# Altium schematic sheet 密码钥匙球锁191014.Schdoc
size A2; SheetNumber: 0; SheetTotal: 0; PageSetup: Record=PageOptions|CenterHorizontal=True|CenterVertical=True|PrintScale=0.52|XCorrection=1.00|YCorrection=1.00|PrintKind=0|BorderSize=5000000|LeftOffset=0|BottomOffset=0|Orientation=2|PaperLength=1000|PaperWidth=1000|Scale=100|PaperSource=7|PrintQuality=-4|MediaType=1|DitherType=10|PaperKind=A4|PrintScaleMode=1
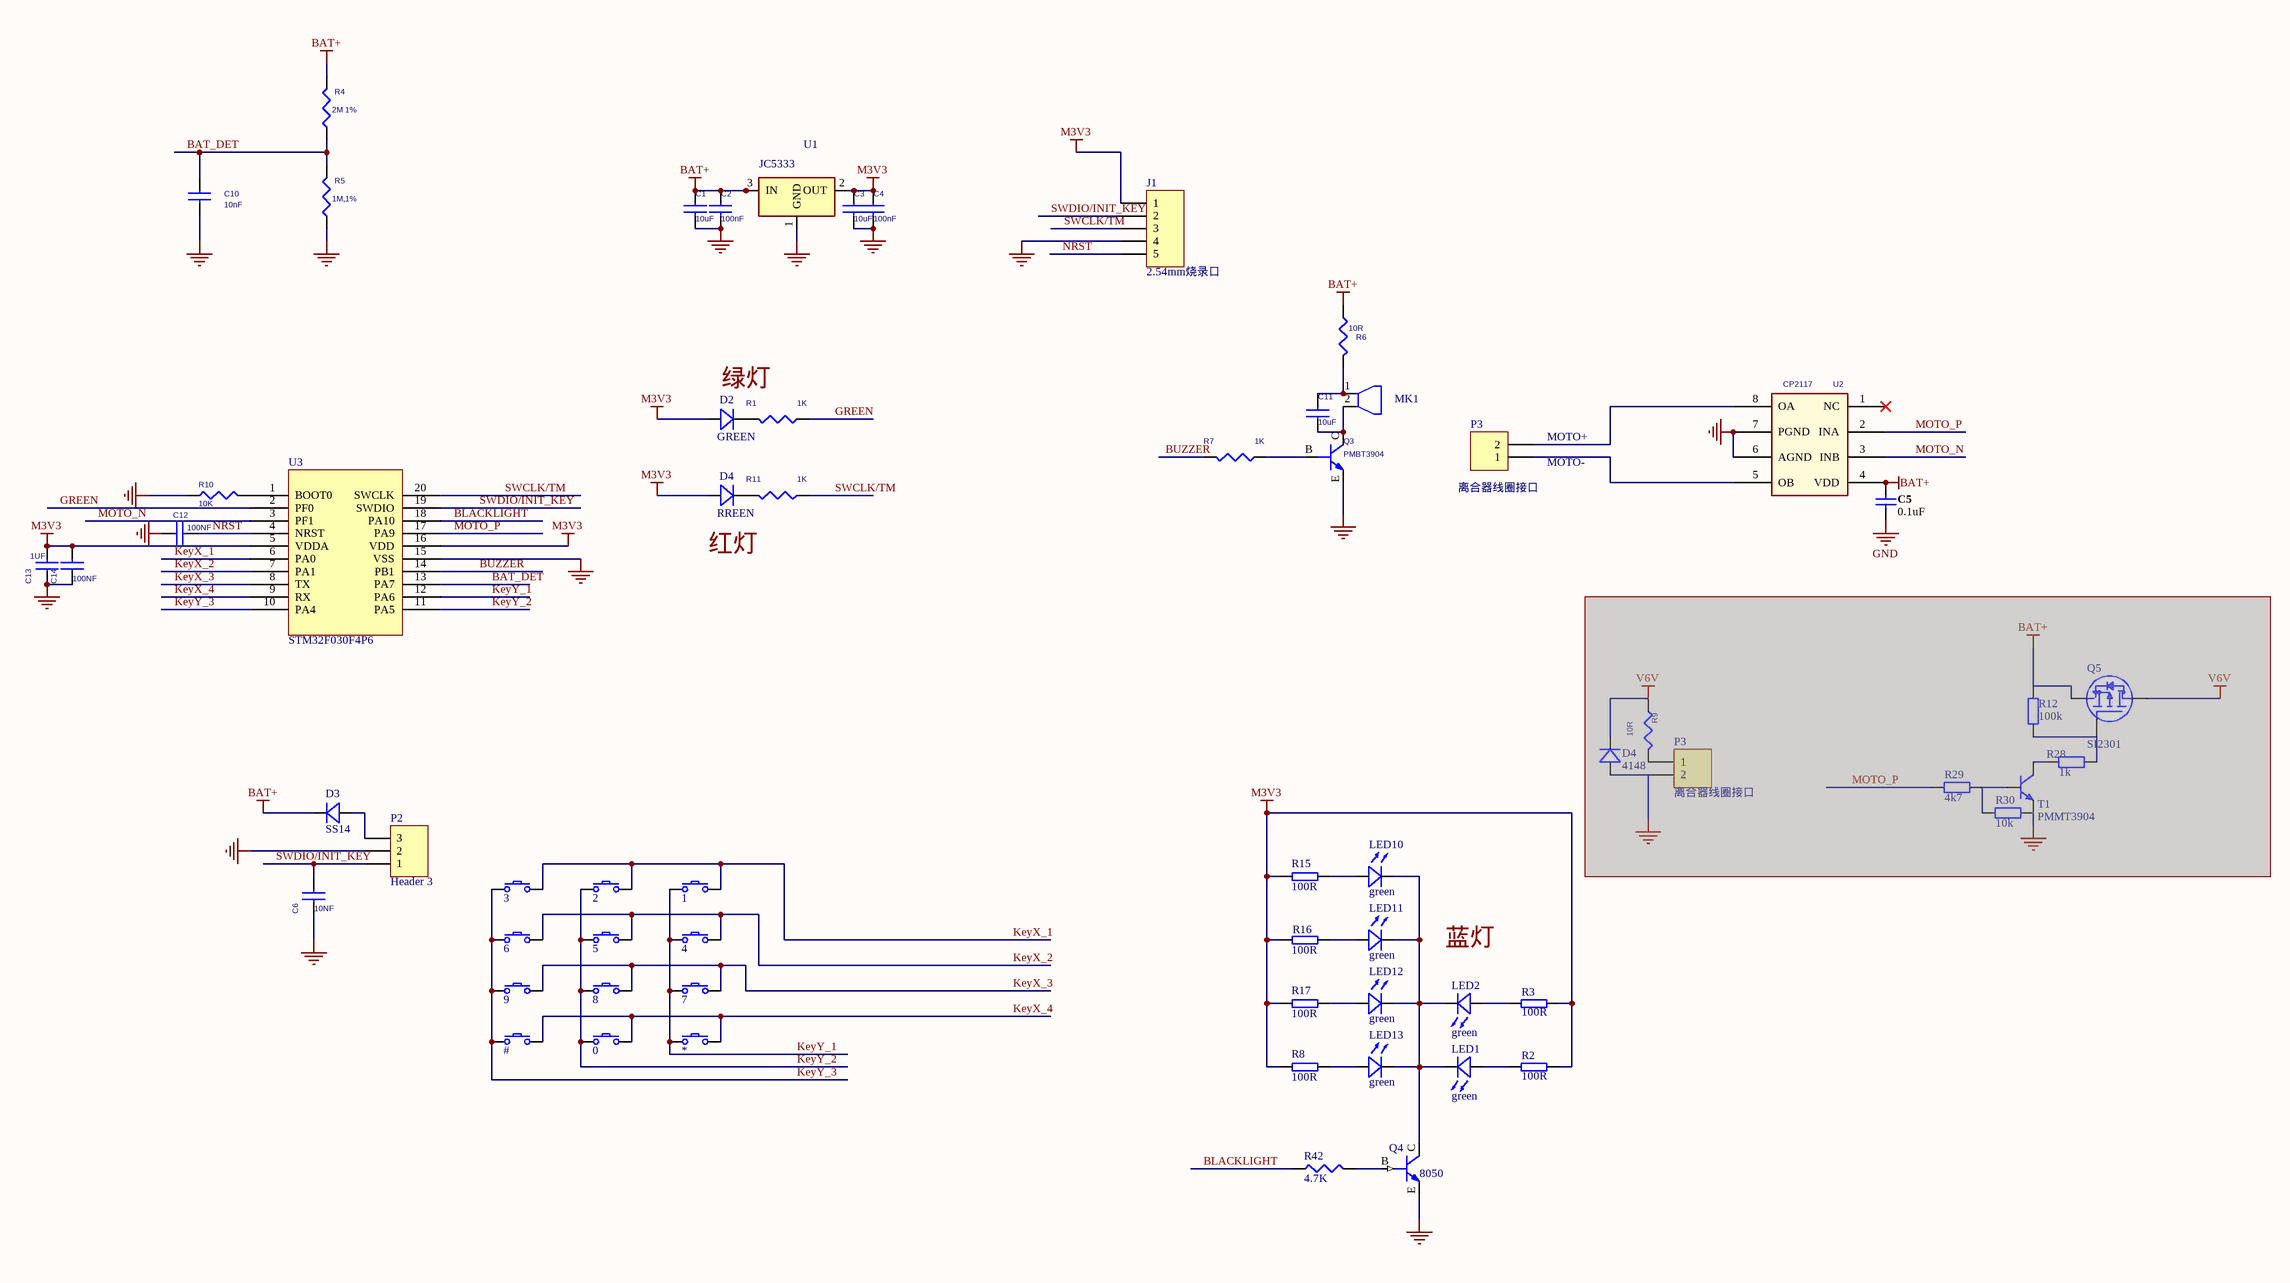
[diagram p0: 密码钥匙球锁191014.Schdoc]

## Parts
(Parts that share a designator on the sheet are numbered #1, #2 ... from top to bottom, then left to right.)
0  SW  [KEY_5.2*3.7*6.4]  (value not drawn)
1  SW  [KEY_5.2*3.7*6.4]  (value not drawn)
2  SW  [KEY_5.2*3.7*6.4]  (value not drawn)
3  SW  [KEY_5.2*3.7*6.4]  (value not drawn)
4  SW  [KEY_5.2*3.7*6.4]  (value not drawn)
5  SW  [KEY_5.2*3.7*6.4]  (value not drawn)
6  SW  [KEY_5.2*3.7*6.4]  (value not drawn)
7  SW  [KEY_5.2*3.7*6.4]  (value not drawn)
8  SW  [KEY_5.2*3.7*6.4]  (value not drawn)
9  SW  [KEY_5.2*3.7*6.4]  (value not drawn)
#  SW  [KEY_5.2*3.7*6.4]  (value not drawn)
*  SW  [KEY_5.2*3.7*6.4]  (value not drawn)
C1  10uF  [C0805X]
C2  100nF  [C0603]
C3  10uF  [C0805X]
C4  100nF  [C0603]
C5  0.1uF  [C0603]
C6  10NF  [C0603]
C10  10nF  [C0603]
C11  10uF  [C0603]
C12  100NF  [C0603]
C13  1UF  [C0603]
C14  100NF  [C0603]
D2  GREEN  [LED(0603)]
D3  SS14  [M7]
D4#1  RREEN  [LED(0603)]
D4#2  4148  [SDO123]  (masked out: inside a compile mask, not in the netlist)
J1  2.54mm烧录口  [5-2.54]
LED1  green  [LED(0603)]
LED2  green  [LED(0603)]
LED10  green  [LED(0603)]
LED11  green  [LED(0603)]
LED12  green  [LED(0603)]
LED13  green  [LED(0603)]
MK1  BUZZER  [BUZZER_D93_L40]  (value not drawn)
P2  Header 3  [3P-2.0]
P3#1  离合器线圈接口  [2P-1.25]
P3#2  离合器线圈接口  [2PIN-2.0]  (masked out: inside a compile mask, not in the netlist)
Q3  PMBT3904  [SOT-23 - BCE]
Q4  8050  [SOT-23 - BCE]
Q5  SI2301  [SOT-23 - GDS]  (masked out: inside a compile mask, not in the netlist)
R1  1K  [R0603]
R2  100R  [R0603]
R3  100R  [R0603]
R4  2M 1%  [R0603]
R5  1M,1%  [R0603]
R6  10R  [R0603]
R7  1K  [R0603]
R8  100R  [R0603]
R9  10R  [R0603]  (masked out: inside a compile mask, not in the netlist)
R10  10K  [R0603]
R11  1K  [R0603]
R12  100k  [R0603]  (masked out: inside a compile mask, not in the netlist)
R15  100R  [R0603]
R16  100R  [R0603]
R17  100R  [R0603]
R28  1k  [R0603]  (masked out: inside a compile mask, not in the netlist)
R29  4k7  [R0603]  (masked out: inside a compile mask, not in the netlist)
R30  10k  [R0603]  (masked out: inside a compile mask, not in the netlist)
R42  4.7K  [R0603]
T1  PMMT3904  [SOT-23-3L]  (masked out: inside a compile mask, not in the netlist)
U1  JC5333  [SOT-23-3L]
U2  CP2117  [SOP8]
U3  STM32F030F4P6  [TSSOP20L1XX]

## Nets
BAT+: C1.1 C2.1 C5.1 D3.K R4.2 R6.1 U1.3(IN) U2.4(VDD)
GND: C1.2 C2.2 C3.2 C4.2 C5.2 C6.1 C10.2 C12.1 C13.1 C14.1 J1.4 P2.2 Q3.E(EMITTER) Q4.E(EMITTER) R5.1 R10.1 U1.1(GND) U2.6(AGND) U2.7(PGND) U3.15(VSS)
M3V3: C3.1 C4.1 C13.2 C14.2 D2.A D4#1.A J1.1 R2.1 R3.1 R8.1 R15.1 R16.1 R17.1 U1.2(OUT) U3.5(VDDA) U3.16(VDD)
BAT_DET: C10.1 R4.1 R5.2 U3.13(PA7)
BLACKLIGHT: R42.1 U3.18(PA10)
BUZZER: R7.2 U3.14(PB1)
GREEN: R1.1 U3.2(PF0)
KeyX_1: 1.2 2.2 3.2 U3.6(PA0)
KeyX_2: 4.2 5.2 6.2 U3.7(PA1)
KeyX_3: 7.2 8.2 9.2 U3.8(TX)
KeyX_4: 0.2 #.2 *.2 U3.9(RX)
KeyY_1: 1.1 4.1 7.1 *.1 U3.12(PA6)
KeyY_2: 0.1 2.1 5.1 8.1 U3.11(PA5)
KeyY_3: 3.1 6.1 9.1 #.1 U3.10(PA4)
MOTO_N: U2.3(INB) U3.3(PF1)
MOTO_P: U2.2(INA) U3.17(PA9)
NRST: C12.2 J1.5 U3.4(NRST)
SWCLK/TM: J1.3 R11.1 U3.20(SWCLK)
SWDIO/INIT_KEY: C6.2 J1.2 P2.1 U3.19(SWDIO)
NetC11_1: C11.1 MK1.2 Q3.C(COLLECTOR)
NetC11_2: C11.2 MK1.1 R6.2
NetD2_K: D2.K R1.2
NetD3_A: D3.A P2.3
NetD4#1_K: D4#1.K R11.2
NetLED1_A: LED1.A R2.2
NetLED1_K: LED1.K LED2.K LED10.K LED11.K LED12.K LED13.K Q4.C(COLLECTOR)
NetLED2_A: LED2.A R3.2
NetLED10_A: LED10.A R15.2
NetLED11_A: LED11.A R16.2
NetLED12_A: LED12.A R17.2
NetLED13_A: LED13.A R8.2
NetP3#1_1: P3#1.1 U2.5(OB)
NetP3#1_2: P3#1.2 U2.8(OA)
NetQ3_B: Q3.B R7.1
NetQ4_B: Q4.B(BASE) R42.2
NetR10_2: R10.2 U3.1(BOOT0)

Not connected (* = marked no-connect by the designer): U2 1(NC)*

## Notes on the sheet
- 绿灯
- (near P3#1) MOTO+
- (near P3#1) MOTO-
- 红灯
- 蓝灯

## Library data of the parts
0-9 # * = SW: Switch
C1-C4 C6 C12-C14 = CAP NP
C5 = CAP-NP: Capacitor, Ceramic; Capacitance: 18 pF; Dielectric: COG; Polarity: Non-Polarized; Rated Voltage: 50 mV; Tolerance: 5 %; Category: Capacitor; Mounting Technology: Surface Mount; Status: Unreleased; Technology: Ceramic
C10 = C_0: ?
C11 = C_0_Dup1
D2 D3 D4#1 D4#2 = D
J1 = Header 5: Header, 5-Pin; LatestRevisionDate: 17-Jul-2002; LatestRevisionNote: Re-released for DXP Platform.; Publisher: Altium Limited
LED1 LED2 LED10-LED13 = LED
MK1 = MICROPHONE_0
P2 = Header 3: Header, 3-Pin; LatestRevisionDate: 17-Jul-2002; LatestRevisionNote: Re-released for DXP Platform.; Publisher: Altium Limited
P3#1 P3#2 = Header 2: Header, 2-Pin; LatestRevisionDate: 17-Jul-2002; LatestRevisionNote: Re-released for DXP Platform.; Publisher: Altium Limited
Q3 = PMBT3904_Dup1: OriginalSymbolOrigin: (0,0); ROOM: power
Q4 = PMBT3904
Q5 = FET-P: MOSFET
R1 R6 R7 R10 R11 = R_Dup1
R2 R3 R8 R15-R17 R42 = R
R4 R5 = R_Dup2
R9 = Res0603
R12 R29 R30 = Res2: Resistor; Value: 1K; Published: 2013年12月24日; LatestRevisionDate: 2013年12月24日; LatestRevisionNote: Re-released for DXP Platform.
R28 = Res2: Resistor; Published: 2013年12月24日; LatestRevisionDate: 2013年12月24日; LatestRevisionNote: Re-released for DXP Platform.; Value: 1K
T1 = NPN_BJT: Bipolar Junction Transistor
U1 = XC6206P302M
U2 = AM24LC02_0
U3 = Component_1